# EasyEDA Pro project ProPrj_New Project_2026-07-15_23-14-34_2026-07-27.epro, board PCB2
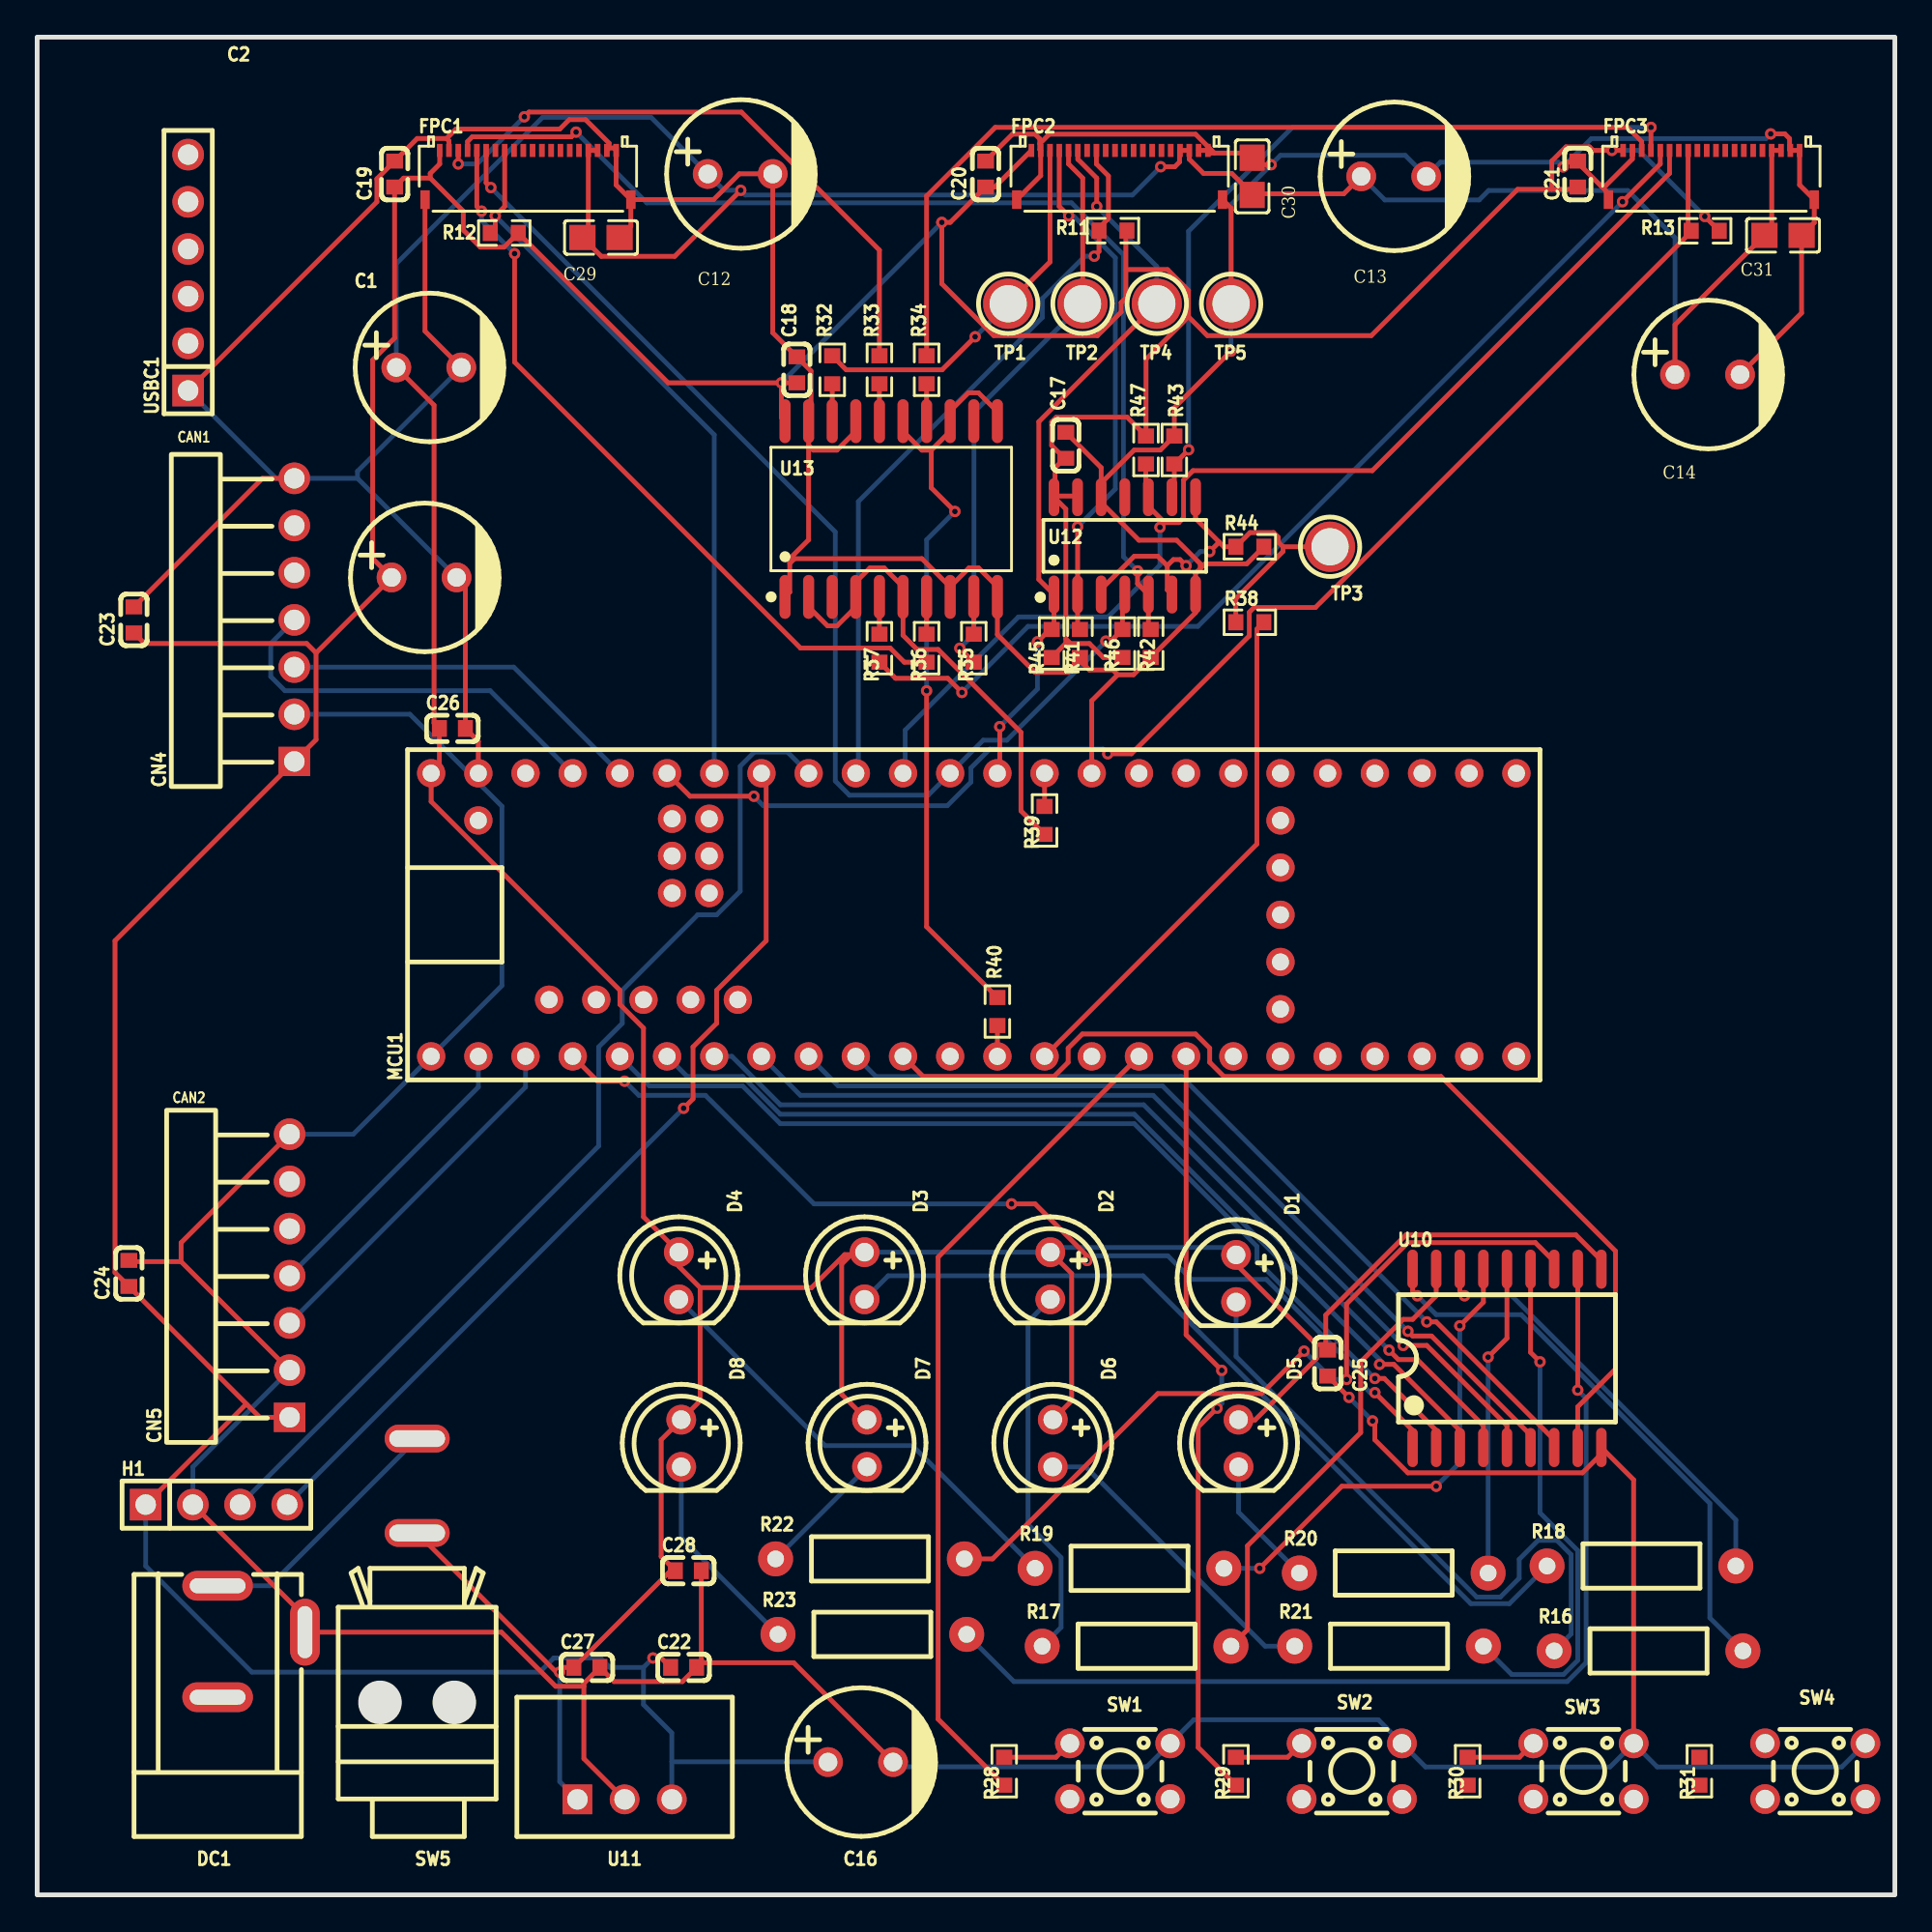
[diagram p5: board, top side]
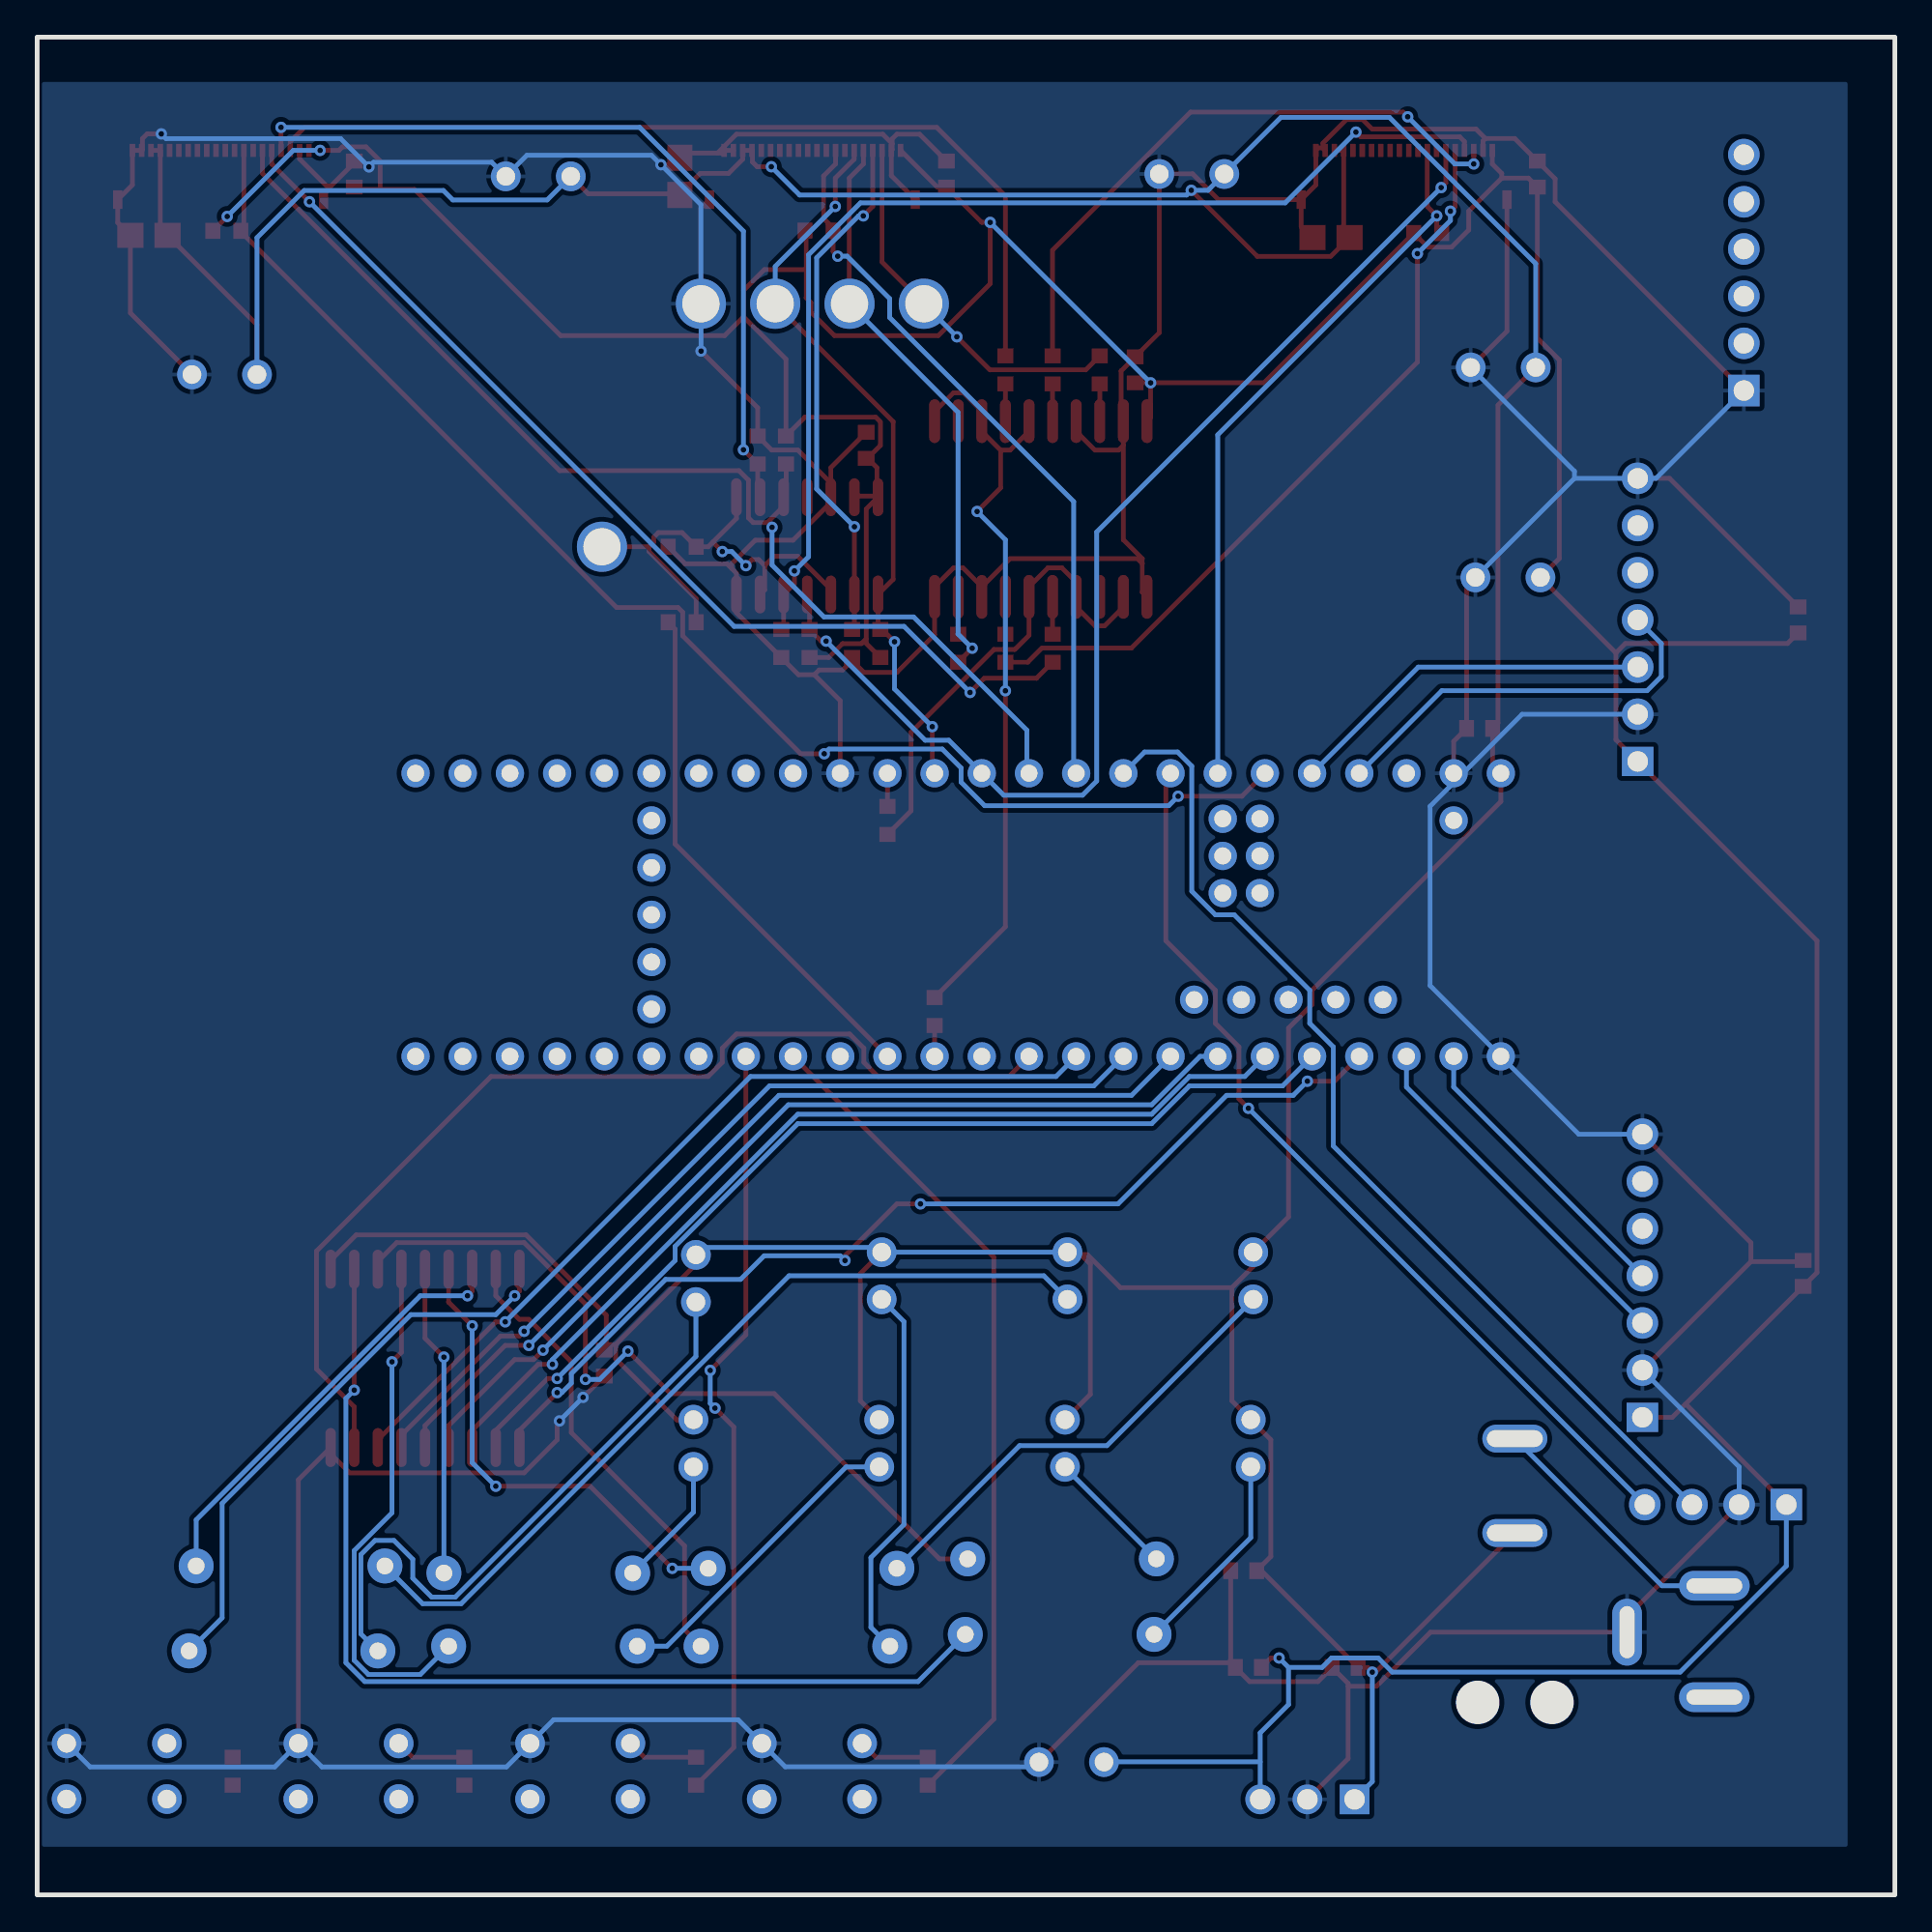
[diagram p6: board, bottom side, seen from below]

Outline 100 x 100 mm; copper layers: Top Layer, Bottom Layer. Coordinates in mm from the lower left corner of the outline.
Outline path: rectangle 0,100 100,0
Stack: Top Layer 0.035mm / Dielectric1 1.51mm FR4 er 4.5 / Bottom Layer 0.035mm

## Design rules (mm)
spacing copperThickness1oz (default): track to track 0.102, other pairs 0.152 to 0.3
spacing copperThickness2oz: track to track 0.203, other pairs 0.152 to 0.3
track width copperThickness1oz (default): min 0.127, default 0.254, max 2.54
track width copperThickness2oz: min 0.203, default 0.254, max 2.54
differential pair differentialPair (default): width min 0.127, default 0.254, max 2.54; gap min 0.152, default 0.152
net GND uses copperRegion

## Placement (name value [footprint] x y rotation side)
C1  220µF 25V  [CAP-TH_BD8.0-P3.50-D0.6-FD]  21.08 82.22 0 top
C2  220µF 25V  [CAP-TH_BD8.0-P3.50-D0.6-FD]  20.83 70.92 0 top
C12  220µF 25V  [CAP-TH_BD8.0-P3.50-D0.6-FD]  37.85 92.63 0 top
C13  220µF 25V  [CAP-TH_BD8.0-P3.50-D0.6-FD]  73.02 92.51 0 top
C14  220µF 25V  [CAP-TH_BD8.0-P3.50-D0.6-FD]  89.92 81.84 0 top
C16  220µF 25V  [CAP-TH_BD8.0-P3.50-D0.6-FD]  44.32 7.15 0 top
C17  100nF  [C0603]  55.37 78.03 90 top
C18  100nF  [C0603]  40.89 82.09 90 top
C19  100nF  [C0603]  19.24 92.63 90 top
C20  100nF  [C0603]  51.05 92.63 90 top
C21  100nF  [C0603]  82.93 92.63 90 top
C22  100nF  [C0603]  34.8 12.24 0 top
C23  100nF  [C0603]  5.21 68.63 90 top
C24  100nF  [C0603]  4.94 33.45 90 top
C25  100nF  [C0603]  69.47 28.63 270 top
C26  100nF  [C0603]  22.35 62.79 0 top
C27  100nF  [C0603]  29.59 12.24 0 top
C28  100nF  [C0603]  35.05 17.45 0 top
C29  10uF  [C0805]  30.35 89.22 0 top
C30  10uF  [C0805]  65.41 92.51 90 top
C31  10uF  [C0805]  93.98 89.33 0 top
CN4  1x7 header 2.54mm  [CONN-TH_7P-P2.54_C9900012194]  13.84 68.63 90 top
CN5  1x7 header 2.54mm  [CONN-TH_7P-P2.54_C9900012194]  13.59 33.32 90 top
D1  5mm LED GREEN  [LED-TH_BD5.0-P2.54-FD]  64.54 33.18 270 top
D2  5mm LED WHITE  [LED-TH_BD5.0-P2.54-FD]  54.54 33.32 270 top
D3  5mm LED BLUE  [LED-TH_BD5.0-P2.54-FD]  44.54 33.32 270 top
D4  5mm LED GREEN  [LED-TH_BD5.0-P2.54-FD]  34.54 33.32 270 top
D5  5mm LED AMBER  [LED-TH_BD5.0-P2.54-FD]  64.67 24.31 270 top
D6  5mm LED RED  [LED-TH_BD5.0-P2.54-FD]  54.67 24.31 270 top
D7  5mm LED RED  [LED-TH_BD5.0-P2.54-FD]  44.67 24.31 270 top
D8  5mm LED YELLOW  [LED-TH_BD5.0-P2.54-FD]  34.67 24.31 270 top
DC1  DC-005 5.5x2.5 5A  [DC-IN-TH_DC-005-2]  12.06 13.64 90 top
FPC1  RiBus LEFT panel  [FPC-SMD_5034802000]  26.42 92.58 0 top
FPC2  RiBus CENTER panel  [FPC-SMD_5034802000]  58.27 92.58 0 top
FPC3  RiBus RIGHT panel  [FPC-SMD_5034802000]  90.12 92.58 0 top
H1  PZ254V-11-04P  [HDR-TH_4P-P2.54-V-M]  9.65 21.01 0 top
MCU1  TEENSY41  [COMM-TH_L60.1-W17.8-P2.54]  50.42 52.76 90 top
R11  10kΩ  [R0603]  57.91 89.59 0 top
R12  10kΩ  [R0603]  25.15 89.46 0 top
R13  10kΩ  [R0603]  89.79 89.57 0 top
R16  150Ω  [R_AXIAL-0.4]  86.74 13.13 0 top
R17  82Ω  [R_AXIAL-0.4]  59.18 13.39 0 top
R18  82Ω  [R_AXIAL-0.4]  86.36 17.7 0 top
R19  150Ω  [R_AXIAL-0.4]  58.8 17.58 0 top
R20  180Ω  [R_AXIAL-0.4]  73.02 17.32 0 top
R21  150Ω  [R_AXIAL-0.4]  72.77 13.39 0 top
R22  150Ω  [R_AXIAL-0.4]  44.83 18.08 0 top
R23  180Ω  [R_AXIAL-0.4]  44.96 14.02 0 top
R28  1kΩ  [R0603]  52.06 6.66 270 top
R29  1kΩ  [R0603]  64.53 6.66 270 top
R30  1kΩ  [R0603]  77 6.66 270 top
R31  1kΩ  [R0603]  89.48 6.66 270 top
R32  33Ω  [R0603]  42.8 82.09 90 top
R33  33Ω  [R0603]  45.34 82.09 90 top
R34  33Ω  [R0603]  47.88 82.09 90 top
R35  33Ω  [R0603]  50.42 67.11 270 top
R36  33Ω  [R0603]  47.88 67.11 270 top
R37  33Ω  [R0603]  45.34 67.11 270 top
R38  33Ω  [R0603]  65.28 68.5 0 top
R39  33Ω  [R0603]  54.23 57.84 270 top
R40  33Ω  [R0603]  51.69 47.55 90 top
R41  100kΩ  [R0603]  56.13 67.36 270 top
R42  100kΩ  [R0603]  59.94 67.36 270 top
R43  100kΩ  [R0603]  61.21 77.77 90 top
R44  100kΩ  [R0603]  65.28 72.57 0 top
R45  10kΩ  [R0603]  54.61 67.36 270 top
R46  10kΩ  [R0603]  58.42 67.36 270 top
R47  10kΩ  [R0603]  59.69 77.77 90 top
SW1  tact 4.5x4.5 THT  [SW-TH_4P-L4.5-W4.5-P3.00-LS5.4]  58.29 6.66 0 top
SW2  tact 4.5x4.5 THT  [SW-TH_4P-L4.5-W4.5-P3.00-LS5.4]  70.77 6.66 0 top
SW3  tact 4.5x4.5 THT  [SW-TH_4P-L4.5-W4.5-P3.00-LS5.4]  83.24 6.66 0 top
SW4  tact 4.5x4.5 THT  [SW-TH_4P-L4.5-W4.5-P3.00-LS5.4]  95.71 6.66 0 top
SW5  SS01-BBIWL-RP20-R  [SW-TH_SS01-BBIWL-RP20-R]  20.46 22.02 0 top
TP1  TP SCLK_C  [TESTPOINT-TH_BD3.2]  52.27 85.65 0 top
TP2  TP MOSI_C  [TESTPOINT-TH_BD3.2]  56.27 85.65 0 top
TP3  TP MISO_NODE  [TESTPOINT-TH_BD3.2]  69.6 72.57 0 top
TP4  TP CS_C  [TESTPOINT-TH_BD3.2]  60.27 85.65 0 top
TP5  TP GND (scope ref)  [TESTPOINT-TH_BD3.2]  64.27 85.65 0 top
U10  ULN2803A  [SOIC-18_L11.6-W7.5-P1.27-LS10.3-BL]  79.12 28.88 0 top
U11  K7803-2000R3 3.3V 2A  [PWRM-TH_R-78EXX-1.0]  31.62 5.14 0 top
U12  SN74LVC125ADR  [SOIC-14_L8.7-W3.9-P1.27-LS6.0-BL]  58.55 72.62 0 top
U13  SN74LVC244ADWR  [SOIC-20_L13.0-W7.6-P1.27-LS10.3-BL]  45.97 74.6 0 top
USBC1  1x6 header 2.54mm  [HDR-TH_6P-P2.54-V-M_BLUE]  8.13 87.33 90 top

## Footprints (pads in the part's own frame, mm; a bottom-side part is the same pattern mirrored in y, then rotated)
C0603
  rect 0.8x0.9 smd: 1(-0.7,0) 2(0.7,0)
C0805
  rect 1.41x1.35 smd: 1(-1,0) 2(1,0)
CAP-TH_BD8.0-P3.50-D0.6-FD
  round 1.6 hole 1: 1(-1.75,0) 2(1.75,0)
COMM-TH_L60.1-W17.8-P2.54
  round 1.524 hole 0.914: 1(-7.62,29.21) 2(-7.62,26.67) 3(-7.62,24.13) 4(-7.62,21.59) 5(-7.62,19.05) 6(-7.62,16.51) 7(-7.62,13.97) 8(-7.62,11.43) 9(-7.62,8.89) 10(-7.62,6.35) 11(-7.62,3.81) 12(-7.62,1.27) 13(-7.62,-1.27) 14(-7.62,-3.81) 15(-7.62,-6.35) 16(-7.62,-8.89) 17(-7.62,-11.43) 18(-7.62,-13.97) 19(-7.62,-16.51) 20(-7.62,-19.05) 21(-7.62,-21.59) 22(-7.62,-24.13) 23(-7.62,-26.67) 24(-7.62,-29.21) 25(7.62,-29.21) 26(7.62,-26.67) 27(7.62,-24.13) 28(7.62,-21.59) 29(7.62,-19.05) 30(7.62,-16.51) 31(7.62,-13.97) 32(7.62,-11.43) 33(7.62,-8.89) 34(7.62,-6.35) 35(7.62,-3.81) 36(7.62,-1.27) 37(7.62,1.27) 38(7.62,3.81) 39(7.62,6.35) 40(7.62,8.89) 41(7.62,11.43) 42(7.62,13.97) 43(7.62,16.51) 44(7.62,19.05) 45(7.62,21.59) 46(7.62,24.13) 47(7.62,26.67) 48(7.62,29.21) 49(-4.57,22.86) 50(-4.57,20.32) 51(-4.57,17.78) 52(-4.57,15.24) 53(-4.57,12.7) 54(-5.08,-16.51) 55(-2.54,-16.51) 56(0,-16.51) 57(2.54,-16.51) 58(5.08,-16.51) 59(5.17,16.24) 60(5.17,14.24) 61(3.17,16.24) 62(3.17,14.24) 63(1.17,16.24) 64(1.17,14.24) 65(5.08,26.67)
CONN-TH_7P-P2.54_C9900012194
  rect 1.575x1.7 hole 1.1: 1(-7.62,0)
  round 1.7 hole 1.1: 2(-5.08,0) 3(-2.54,0) 4(0,0) 5(2.54,0) 6(5.08,0) 7(7.62,0)
DC-IN-TH_DC-005-2
  oval 1.6x3.8 hole 0.8x3: 1(2.999,2.35) 2(-3,2.35)
  oval 3.6x1.6 hole 2.8x0.8: 3(0.5,-2.35)
FPC-SMD_5034802000
  rect 0.3x0.7 smd: 1(-4.75,1.325) 2(-4.25,1.325) 3(-3.75,1.325) 4(-3.25,1.325) 5(-2.75,1.325) 6(-2.25,1.325) 7(-1.75,1.325) 8(-1.25,1.325) 9(-0.75,1.325) 10(-0.25,1.325) 11(0.25,1.325) 12(0.75,1.325) 13(1.25,1.325) 14(1.75,1.325) 15(2.25,1.325) 16(2.75,1.325) 17(3.25,1.325) 18(3.75,1.325) 19(4.25,1.325) 20(4.75,1.325)
  rect 0.5x1 smd: 21(5.54,-1.325) 22(-5.54,-1.325)
HDR-TH_4P-P2.54-V-M
  rect 1.7x1.7 hole 1.1: 1(-3.81,0)
  round 1.7 hole 1.1: 2(-1.27,0) 3(1.27,0) 4(3.81,0)
HDR-TH_6P-P2.54-V-M_BLUE
  rect 1.7x1.7 hole 1.1: 1(-6.35,0)
  round 1.7 hole 1.1: 2(-3.81,0) 3(-1.27,0) 4(1.27,0) 5(3.81,0) 6(6.35,0)
LED-TH_BD5.0-P2.54-FD
  round 1.6 hole 1: 1(-1.27,0) 2(1.27,0)
PWRM-TH_R-78EXX-1.0
  rect 1.6x1.6 hole 1.1: 1(-2.54,0)
  round 1.6 hole 1.1: 2(0,0) 3(2.54,0)
R0603
  rect 0.806x0.864 smd: 1(-0.753,0) 2(0.753,0)
R_AXIAL-0.4
  round 1.879 hole 0.899: 1(-5.08,0) 2(5.08,0)
SOIC-14_L8.7-W3.9-P1.27-LS6.0-BL
  oval 0.574x2.038 smd: 1(-3.81,-2.619) 2(-2.54,-2.619) 3(-1.27,-2.619) 4(0,-2.619) 5(1.27,-2.619) 6(2.54,-2.619) 7(3.81,-2.619) 8(3.81,2.619) 9(2.54,2.619) 10(1.27,2.619) 11(0,2.619) 12(-1.27,2.619) 13(-2.54,2.619) 14(-3.81,2.619)
SOIC-18_L11.6-W7.5-P1.27-LS10.3-BL
  oval 0.56x2.1 smd: 1(-5.08,-4.8) 2(-3.81,-4.8) 3(-2.54,-4.8) 4(-1.27,-4.8) 5(0,-4.8) 6(1.27,-4.8) 7(2.54,-4.8) 8(3.81,-4.8) 9(5.08,-4.8) 10(5.08,4.8) 11(3.81,4.8) 12(2.54,4.8) 13(1.27,4.8) 14(0,4.8) 15(-1.27,4.8) 16(-2.54,4.8) 17(-3.81,4.8) 18(-5.08,4.8)
SOIC-20_L13.0-W7.6-P1.27-LS10.3-BL
  oval 0.595x2.36 smd: 1(-5.715,-4.73) 2(-4.445,-4.73) 3(-3.175,-4.73) 4(-1.905,-4.73) 5(-0.635,-4.73) 6(0.635,-4.73) 7(1.905,-4.73) 8(3.175,-4.73) 9(4.445,-4.73) 10(5.715,-4.73) 11(5.715,4.73) 12(4.445,4.73) 13(3.175,4.73) 14(1.905,4.73) 15(0.635,4.73) 16(-0.635,4.73) 17(-1.905,4.73) 18(-3.175,4.73) 19(-4.445,4.73) 20(-5.715,4.73)
SW-TH_4P-L4.5-W4.5-P3.00-LS5.4
  round 1.6 hole 1: 1(-2.7,1.5) 2(2.7,1.5) 3(-2.7,-1.5) 4(2.7,-1.5)
SW-TH_SS01-BBIWL-RP20-R
  oval 3.5x1.5 hole 3x0.9: 1(0,2.54) 1a(0,-2.54)
TESTPOINT-TH_BD3.2
  round 2.7 hole 2: 1(0,0)

## Nets
As in the schematic.

Pads without a net: DC1 2; FPC1 7 9 10 11 12 13 14 15 16; FPC2 7 9 10 11 12 13 14 15 16; FPC3 7 9 10 11 12 13 14 15 16; MCU1 12 15 20 21 22 23 24 25 26 27 28 29 30 31 32 33 46 49 50 51 52 53 54 55 56 57 58 59 60 61 62 63 64 65; R31 1; SW1 3 4; SW2 3 4; SW3 3 4; SW4 3 4; U12 11; U13 3 12

## Via types
v1: diameter 0.61, hole 0.305, Top Layer to Bottom Layer, 65 vias

## Routing (per net, layer and track width the routed paths; a pad name or vN(x,y) marks a point on that pad's centre or on a via; arc(x,y) is an arc through that point)
+3V3: length 291.2
  Top Layer w0.254: C18.1 33.97,81.39 R12.2 25.14,88.7 23.86,88.7 22.94,89.62 22.94,90.63 21.16,92.41 ; 15.01,66.85 C2.1 18.06,71.93 18.06,82.62 19.24,83.8 C19.1 19.72,92.41 21.16,92.41 ; 15.01,66.85 14.51,67.36 5.78,67.36 C23.1 ; 15.01,66.85 15.01,62.18 CN4.1 4.19,51.36 4.19,33.5 C24.1 11.98,25.7 13.59,25.7 ; 21.16,92.41 21.16,92.67 21.67,93.17 FPC1.1 ; R46.2 57.39,66.61 56.64,67.36 55.63,67.36 55.37,67.61 ; C22.1 33.59,12.75 v1(33.15,12.75) ; 58.6,87.49 60.85,87.49 61.98,86.36 61.98,84.95 ; FPC2.1 51.55,91.93 C20.1 49.15,90.03 v1(48.7,90.03) 48.7,86.73 51.49,83.93 57.08,83.93 58.35,85.2 58.35,85.71 58.6,85.96 58.6,89.52 R11.2 ; U12.13 55.95,75.3 54.79,75.3 ; 54.79,75.3 U12.14 55.37,74.6 55.37,67.37 R45.2 ; 54.79,75.3 54.79,76.82 55.3,77.33 ; 61.98,84.95 59.69,82.66 R47.2 58.67,79.54 54.86,79.54 54.61,79.29 54.61,78.02 55.3,77.33 ; 61.98,84.95 62.99,83.93 71.82,83.93 79.69,91.81 82.81,91.81 C21.1 ; 81.53,91.81 81.53,93.33 82.3,94.09 83.57,94.09 83.75,93.9 FPC3.1 ; 55.3,77.33 C17.1 ; H1.1 11.24,26.4 11.29,26.4 ; U13.20 40.06,79.53 v1(40.06,81.39) ; v1(89.77,90.35) R13.2
  Bottom Layer w0.254: 32.64,12.24 30.83,12.24 30.32,12.75 27.81,12.75 27.05,11.99 11.56,11.99 5.84,17.7 H1.1 ; 32.64,12.24 v1(33.15,12.75) ; 32.64,12.24 32.64,10.24 34.16,8.72 U11.3 ; v1(84.77,93.9) 86.21,93.9 v1(89.77,90.35) ; 34.16,7.16 42.56,7.16 C16.1 ; v1(40.06,81.39) v1(48.7,90.03)
+5V: length 304.3
  Top Layer w0.254: D7.1 43.31,26.94 43.31,33.95 43.82,34.46 ; 68.86,29.62 68.86,28.86 65.55,25.56 64.69,25.56 D5.1 ; 68.86,29.62 64.54,33.94 64.54,34.45 ; 68.86,29.62 69.27,29.62 69.36,29.53 69.36,29.43 ; v1(60.48,93.03) 61.24,93.03 61.5,93.28 61.5,93.88 FPC2.17 FPC2.18 62.02,93.43 62.78,92.67 64.31,92.67 65.41,91.57 ; 35.69,32.68 35.69,26.59 D8.1 33.59,24.5 33.59,18.21 34.35,17.45 34.1,17.45 C27.1 28.38,12.24 v1(28.13,11.99) 27.95,11.99 SW5.1a ; 35.69,32.68 34.54,33.83 D4.1 32.64,36.49 32.64,46.66 31.37,47.93 31.37,48.69 21.21,58.85 MCU1.48 21.65,60.82 C26.1 21.36,63.08 21.36,80.19 C1.1 ; 35.69,32.68 41.69,32.68 43.47,34.46 44.41,34.46 D3.1 ; 69.36,29.43 C25.1 ; 69.36,29.43 69.36,31.21 73.68,35.53 82.83,35.53 84.2,34.15 U10.10 ; v1(37.87,91.76) 34.32,88.2 30.37,88.2 C29.1 29.67,89.53 FPC1.17 FPC1.18 ; FPC3.18 FPC3.17 93.37,89.72 C31.1 88.17,84.52 C14.1 ; 65.41,91.57 C30.1 ; 65.41,91.57 70.33,91.57 C13.1 ; D2.1 55.69,33.45 55.69,26.59 D6.1
  Bottom Layer w0.254: U11.1 28.13,6.09 v1(28.13,11.99) ; C13.1 72.55,91.24 77.63,91.24 78.13,91.74 85.63,91.74 88.17,89.2 C14.1 ; D3.1 D2.1 54.79,34.85 64.14,34.85 64.54,34.45 ; C1.1 19.33,87.81 27.21,95.68 33.05,95.68 C12.1 36.97,91.76 v1(37.87,91.76) 38.13,91.5 58.96,91.5 v1(60.48,93.03)
+5V_SW_IN: length 14
  Bottom Layer w0.254: SW5.1 12.53,16.64 DC1.1
GND: length 503.9
  Top Layer w0.254: v1(64.26,83.1) 61.21,80.05 R43.2 60.46,77.77 59.05,77.77 57.28,76 U12.12 ; 35.75,12.5 C28.2 ; 35.75,12.5 C22.2 34.74,11.48 31.05,11.48 C27.2 29.43,11.38 29.43,11.23 ; 35.75,12.5 40.72,12.5 C16.2 ; 29.43,11.23 29.43,7.33 U11.2 ; 29.43,11.23 27.91,11.23 24.99,14.14 DC1.3 14.42,14.97 H1.2 ; 53.98,94.27 53.98,93.95 FPC2.2 54.02,92.54 FPC2.22 ; 53.98,94.27 53.98,94.52 53.72,94.78 52.5,94.78 C20.2 ; 53.98,94.27 54.48,94.78 62.36,94.78 63.37,93.76 ; SW3.2 85.94,22.34 U10.9 84.2,23.73 83.19,22.72 73.79,22.72 72.01,24.49 72.01,25.39 v1(71.88,25.51) ; FPC1.21 36.41,91.25 37.8,92.64 39.59,92.64 C12.2 39.6,84.09 C18.2 41.66,82.03 41.66,79.46 U13.19 41.53,78.02 ; FPC1.21 31.17,92.04 FPC1.20 31.04,94.04 30.79,94.04 ; FPC1.21 31.96,89.82 C29.2 ; 40.51,71.67 40.77,71.93 47.63,71.93 49.15,70.4 U13.8 49.15,70.41 50.17,71.43 50.67,71.43 51.69,70.41 U13.10 51.69,67.84 53.72,65.81 55.5,65.81 56.13,66.44 ; 30.79,94.04 30.79,94.29 29.52,95.56 28.64,95.56 28.13,95.05 22.55,95.05 22.04,94.54 ; 30.79,94.04 FPC1.19 ; TP5.1 64.27,90.79 FPC2.21 ; v1(82.14,93.01) 82.39,93.27 82.9,93.27 ; 56.13,66.44 56.64,65.93 57.91,65.93 58.17,65.68 ; 56.13,66.44 R41.2 ; 82.9,93.27 82.9,93.3 C21.2 ; 82.9,93.27 84.58,91.59 FPC3.22 ; 22.04,94.54 20.46,94.54 C19.2 18.29,92.38 18.29,91.14 USBC1.1 ; 22.04,94.54 22.17,94.41 FPC1.2 ; C17.2 57.28,76.82 U12.12 ; 13.84,76.25 12.13,76.25 5.21,69.33 ; 7.75,34.09 5,34.09 C24.2 ; 7.75,34.09 7.75,35.1 CN5.7 ; 7.75,34.09 CN5.2 ; v1(66.42,93.13) 65.78,93.13 C30.2 65.15,93.76 63.16,93.76 FPC2.20 FPC2.19 ; C2.2 23.05,70.44 C26.2 23.75,62.09 MCU1.47 ; U13.17 44.07,78.78 43.05,77.77 41.78,77.77 41.53,78.02 ; 84.17,92 84.43,92 85.87,93.44 FPC3.2 ; v1(70.61,26.78) C25.2 ; 62.61,71.4 62.61,71.65 61.34,72.92 59.31,72.92 57.28,74.95 U12.12 ; C1.2 20.88,84.17 FPC1.22 ; U13.1 40.51,70.12 40.51,71.93 41.53,72.94 41.53,78.02 ; v1(93.32,94.79) 94.08,94.79 94.33,94.54 94.33,93.94 FPC3.19 FPC3.20 94.87,92.04 FPC3.21 95.66,90.01 C31.2 94.98,85.15 C14.2 ; 58.17,65.68 56.77,64.28 MCU1.34 ; 58.17,65.68 59.02,65.68 R42.2 62.36,69.02 U12.7 62.36,71.14 62.86,71.65 65.11,71.65 R44.2
  Bottom Layer w0.254: v1(93.32,94.79) 93.06,94.54 83.67,94.54 v1(82.14,93.01) 81.89,93.27 75.54,93.27 C13.2 73.64,93.64 66.93,93.64 v1(66.42,93.13) 64.27,90.98 TP5.1 64.26,85.64 v1(64.26,83.1) ; CN5.7 17.02,40.94 MCU1.1 25.02,48.95 25.02,58.6 23.75,59.87 ; H1.2 8.38,23.04 CN5.2 ; C2.2 17.24,76.25 ; 17.24,76.25 17.24,76.63 C1.2 ; 17.24,76.25 12.85,76.25 USBC1.1 ; v1(71.88,25.51) v1(70.61,26.78) ; 23.75,59.87 MCU1.47 ; 23.75,59.87 20.07,63.55 13.84,63.55 ; C16.2 46.33,6.89 59.73,6.89 SW1.2 62.26,9.42 72.2,9.42 SW2.2 74.74,6.88 84.67,6.88 SW3.2 87.21,6.88 97.14,6.88 98.41,8.16
BTN1: length 45.2
  Top Layer w0.254: R28.2 48.5,9.46 48.5,34.33 MCU1.16
BTN1_SW: length 3.8
  Top Layer w0.254: R28.1 54.85,7.41 SW1.1
BTN2: length 41.4
  Top Layer w0.254: MCU1.17 61.85,30.15 v1(63.77,28.23) ; v1(63.51,26.2) 62.5,25.18 62.5,7.93 R29.2
  Bottom Layer w0.254: v1(63.77,28.23) 63.77,26.45 v1(63.51,26.2)
BTN2_SW: length 3.8
  Top Layer w0.254: R29.1 67.32,7.41 SW2.1
BTN3_SW: length 3.8
  Top Layer w0.254: R30.1 79.79,7.41 SW3.1
CAN1_RX: length 22
  Bottom Layer w0.254: MCU1.45 24.38,64.82 13.34,64.82 12.57,65.58 12.57,67.36 CN4.4
CAN1_TX: length 19.9
  Bottom Layer w0.254: CN4.3 25.65,66.09 MCU1.44
CAN2_RX: length 16
  Bottom Layer w0.254: MCU1.2 23.75,43.48 CN5.4
CAN2_TX: length 19.6
  Bottom Layer w0.254: 13.59,30.78 26.29,43.48 MCU1.3
CS_C: length 39.6
  Top Layer w0.254: v1(51.82,62.88) 51.82,60.5 MCU1.36 ; TP4.1 53.92,79.3 53.92,70.81 U12.1 54.74,68.34 54.61,68.22 ; v1(57.04,90.89) 57.04,92.41 56.02,93.43 FPC2.6 ; 54.61,68.22 R45.1 ; 54.61,68.22 v1(53.85,67.45)
  Bottom Layer w0.254: v1(51.82,62.88) 53.85,64.91 v1(53.85,67.45) ; v1(57.04,90.89) 60.27,87.65 TP4.1
CS_L: length 63.1
  Top Layer w0.254: U12.4 58.42,69.87 R46.1 57.79,67.49 v1(57.53,67.49) ; v1(24.42,91.9) 24.17,92.16 FPC1.6
  Bottom Layer w0.254: v1(57.53,67.49) 52.2,62.15 50.93,62.15 MCU1.37 47.97,59.19 43.73,59.19 42.96,59.96 42.96,73.36 v1(24.42,91.9)
CS_R: length 63.3
  Top Layer w0.254: 60.69,73.87 v1(60.44,73.62) ; 60.69,73.87 61.46,73.87 61.71,74.12 61.71,76.16 62.22,76.66 71.87,76.66 87.87,92.67 FPC3.6 ; 60.69,73.87 59.68,74.89 59.68,77.01 R47.1 ; U12.10 59.72,75.14 59.68,75.14
  Bottom Layer w0.254: MCU1.38 46.72,60.49 46.72,62.69 52.82,68.79 57.65,68.79 60.44,71.58 v1(60.44,73.62)
I2C_SCL: length 50.2
  Top Layer w0.254: MCU1.41 39.24,60.12 39.24,51.36 36.58,48.69 36.58,46.91 35.31,45.64 35.31,42.85 v1(34.8,42.34)
  Bottom Layer w0.254: H1.4 v1(34.8,42.34)
I2C_SDA: length 56
  Bottom Layer w0.254: H1.3 30.23,40.31 30.23,45.64 31.5,46.91 31.5,48.69 35.56,52.76 36.58,52.76 37.85,54.03 37.85,60.76 38.61,61.52 40.38,61.52 MCU1.40
MISO: length 28.3
  Top Layer w0.254: MCU1.14 65.66,56.57 65.66,68.13 R38.2
MISO_C: length 28.1
  Top Layer w0.254: v1(55.53,90.38) 55.02,90.89 FPC2.4 ; v1(56.01,73.65) U12.2 56.01,68.24 R41.1
  Bottom Layer w0.254: v1(56.01,73.65) 58.04,75.68 58.04,88.12 55.78,90.38 v1(55.53,90.38)
MISO_L: length 59.5
  Top Layer w0.254: v1(59.24,71.27) 59.24,70.58 U12.5 59.82,68.24 R42.1 ; FPC1.4 23.17,94.38 23.42,94.64 28.76,94.64 v1(29.01,94.89)
  Bottom Layer w0.254: v1(29.01,94.89) 32.82,91.08 55.68,91.08 58.47,88.29 58.47,72.03 v1(59.24,71.27)
MISO_NODE: length 24.9
  Top Layer w0.254: U12.8 62.36,74.09 63.88,72.57 R44.1 65.29,73.33 66.56,73.33 66.81,73.08 66.81,72.82 67.06,72.57 ; R38.1 64.52,69.77 67.06,72.31 67.06,72.57 ; 60.83,71.55 60.83,70.25 U12.6 ; 60.83,71.55 61.16,71.88 61.52,71.88 v1(61.85,71.55) ; 60.83,71.55 60.33,72.06 59.05,72.06 57.28,70.28 U12.3 ; 67.06,72.57 TP3.1 ; 63.63,72.82 v1(63.12,72.31)
  Bottom Layer w0.254: v1(61.85,71.55) 62.61,72.31 v1(63.12,72.31)
MISO_R: length 43.1
  Top Layer w0.254: v1(61.98,77.79) R43.1 61.21,75.36 U12.9 ; FPC3.4 v1(86.87,95.14)
  Bottom Layer w0.254: v1(86.87,95.14) 67.57,95.14 61.98,89.56 v1(61.98,77.79)
MOSI: length 41.1
  Top Layer w0.254: v1(47.88,64.81) 47.88,52.11 R40.2 ; U13.11 51.69,79.84 50.67,80.85 50.13,80.85 49.15,79.88 U13.13 49.15,78.78 48.13,77.77 ; 48.13,77.77 48.13,75.74 v1(49.4,74.47) ; 48.13,77.77 47.63,77.77 46.61,78.78 U13.15
  Bottom Layer w0.254: v1(47.88,64.81) 47.88,72.94 v1(49.4,74.47)
MOSI_C: length 30.9
  Top Layer w0.254: FPC2.5 55.52,93.17 56.28,92.41 56.28,85.66 TP2.1 ; v1(49.67,67.11) R35.2
  Bottom Layer w0.254: TP2.1 50.43,79.81 50.43,67.87 v1(49.67,67.11)
MOSI_C_PRE: length 2
  Top Layer w0.254: U13.9 R35.1
MOSI_L: length 41.1
  Top Layer w0.254: v1(23.92,90.63) 23.67,90.89 FPC1.5 ; R36.2 46.68,66.35 45.92,67.12 41.09,67.12 25.7,82.51 v1(25.7,88.35)
  Bottom Layer w0.254: v1(23.92,90.63) 23.92,90.13 v1(25.7,88.35)
MOSI_L_PRE: length 2
  Top Layer w0.254: U13.7 R36.1
MOSI_MCU: length 1.7
  Top Layer w0.254: MCU1.13 R40.1
MOSI_R: length 55.2
  Top Layer w0.254: R37.2 46.2,65.49 49.02,65.49 v1(49.78,64.73) ; FPC3.5 87.37,93.17 v1(85.34,91.14)
  Bottom Layer w0.254: v1(85.34,91.14) 62.48,68.28 53.34,68.28 v1(49.78,64.73)
MOSI_R_PRE: length 2
  Top Layer w0.254: U13.5 R37.1
PD_C: length 39.9
  Top Layer w0.254: 57.16,89.73 57.16,88.46 v1(56.9,88.21) ; 57.16,89.73 R11.1 ; 57.16,89.73 57.67,90.24 57.67,92.53 57.02,93.17 FPC2.8
  Bottom Layer w0.254: v1(56.9,88.21) 56.4,88.21 54.11,85.92 54.11,84.91 44.2,75 44.2,60.51 MCU1.39
PD_L: length 39.7
  Top Layer w0.254: R12.1 24.66,89.73 v1(24.66,90.38) 25.17,90.89 FPC1.8
  Bottom Layer w0.254: v1(24.66,90.38) 36.45,78.59 MCU1.42
PD_R: length 74.7
  Top Layer w0.254: 88.87,89.87 88.87,89.36 68.81,69.3 65.5,69.3 65.25,69.04 65.25,67.77 58.9,61.42 v1(57.63,61.42) ; 88.87,89.87 R13.1 ; 88.87,89.87 FPC3.8 ; v1(38.58,59.14) 35.15,59.14 MCU1.43
  Bottom Layer w0.254: v1(38.58,59.14) 39.09,58.63 48.99,58.63 50.26,59.9 50.26,60.66 51.28,61.68 57.38,61.68 v1(57.63,61.42)
SCLK: length 25.7
  Top Layer w0.254: U13.2 41.53,69.32 42.55,68.31 43.05,68.31 44.07,69.32 U13.4 44.07,70.67 44.83,71.43 45.59,71.43 46.61,70.41 U13.6 46.61,67.8 47.37,67.04 48.5,67.04 52.96,62.58 52.96,58.35 R39.2
SCLK_C: length 20.4
  Top Layer w0.254: R32.2 43.55,82.09 48.71,82.09 v1(50.49,83.87) ; TP1.1 54.52,87.9 FPC2.3
  Bottom Layer w0.254: TP1.1 v1(50.49,83.87)
SCLK_C_PRE: length 2
  Top Layer w0.254: U13.18 R32.1
SCLK_L: length 33.3
  Top Layer w0.254: FPC1.3 v1(22.67,93.17) ; v1(26.22,95.71) 26.48,95.97 37.91,95.97 45.34,88.54 R33.2
  Bottom Layer w0.254: v1(26.22,95.71) 23.68,93.17 v1(22.67,93.17)
SCLK_L_PRE: length 2
  Top Layer w0.254: U13.16 R33.1
SCLK_MCU: length 1.8
  Top Layer w0.254: MCU1.35 R39.1
SCLK_R: length 49.4
  Top Layer w0.254: R34.2 47.88,91.45 51.57,95.14 85.61,95.14 86.37,94.38 FPC3.3
SCLK_R_PRE: length 2
  Top Layer w0.254: U13.14 R34.1
TT1: length 55.1
  Top Layer w0.254: U10.1 74.04,25 v1(72.01,27.03) ; MCU1.4 30.17,43.8 v1(31.62,43.8) ; v1(56.52,34.15) 56.52,34.4 53.72,37.19 v1(52.45,37.19)
  Bottom Layer w0.254: v1(72.01,27.03) 71.76,27.03 71.25,27.54 71.25,28.05 66.17,33.13 62.14,33.13 60.86,34.4 56.77,34.4 v1(56.52,34.15) ; v1(52.45,37.19) 41.82,37.19 35.97,43.04 32.39,43.04 v1(31.62,43.8)
TT1_LED_K: length 34.1
  Bottom Layer w0.254: R16.1 82.57,14.04 82.57,18.32 81.81,19.08 80.8,19.08 79.78,18.06 79.78,17.05 78.76,16.03 77.49,16.03 64.54,28.98 D1.2
TT1_OUT: length 30.6
  Top Layer w0.254: U10.18 74.04,32.5 v1(74.3,32.25)
  Bottom Layer w0.254: R16.2 90.04,14.91 90.04,21.07 79.88,31.23 75.31,31.23 v1(74.3,32.25)
TT2: length 53.7
  Top Layer w0.254: v1(72.01,27.8) 72.52,27.8 75.31,25 U10.2
  Bottom Layer w0.254: MCU1.5 32.96,43.54 37.97,43.54 40.01,41.51 59.05,41.51 65.66,34.91 65.66,34.15 v1(72.01,27.8)
TT2_LED_K: length 20.3
  Bottom Layer w0.254: D2.2 53.34,30.86 53.34,19.93 55.12,18.16 55.12,14.4 R17.1
TT2_OUT: length 25.2
  Top Layer w0.254: U10.17 75.31,32.25 74.04,30.98 73.53,30.98 71.25,28.69 71.25,24.88 65.15,18.79 65.15,14.28 R17.2
TT3: length 52.1
  Top Layer w0.254: v1(72.26,28.56) 73.02,28.56 76.58,25 U10.3
  Bottom Layer w0.254: v1(72.26,28.56) 72.26,28.81 59.05,42.02 40.01,42.02 37.97,44.05 34.99,44.05 MCU1.6
TT3_LED_K: length 45.4
  Bottom Layer w0.254: R18.1 79.25,15.67 77.18,15.67 59.52,33.32 45.81,33.32 D3.2
TT3_OUT: length 23.6
  Top Layer w0.254: v1(76.83,32.25) 76.58,32.5 U10.16
  Bottom Layer w0.254: v1(76.83,32.25) 79.38,32.25 91.44,20.18 R18.2
TT4: length 50.8
  Top Layer w0.254: v1(72.77,29.32) 73.28,28.81 74.3,28.81 77.85,25.26 U10.4
  Bottom Layer w0.254: MCU1.7 37.4,45.14 40.01,42.53 59.56,42.53 v1(72.77,29.32)
TT4_LED_K: length 25.2
  Bottom Layer w0.254: R19.1 47.12,24.18 42.41,24.18 D4.2
TT4_OUT: length 26
  Top Layer w0.254: v1(75.31,22) 70.23,22 v1(65.81,17.58) ; U10.15 77.85,31.9 v1(76.58,30.63)
  Bottom Layer w0.254: v1(75.31,22) 76.58,23.27 v1(76.58,30.63) ; v1(65.81,17.58) R19.2
TT5: length 49.5
  Top Layer w0.254: v1(73.53,29.57) 74.8,29.57 79.12,25.26 U10.5
  Bottom Layer w0.254: v1(73.53,29.57) 60.07,43.04 41.09,43.04 MCU1.8
TT5_LED_K: length 7.1
  Bottom Layer w0.254: R20.1 64.67,20.6 D5.2
TT5_OUT: length 16.8
  Top Layer w0.254: v1(78.11,28.95) 79.12,29.96 U10.14
  Bottom Layer w0.254: v1(78.11,28.95) R20.2
TT6: length 48
  Top Layer w0.254: v1(73.79,30.34) 74.04,30.08 75.06,30.08 80.39,24.75 U10.6
  Bottom Layer w0.254: MCU1.9 43.12,43.54 60.58,43.54 v1(73.79,30.34)
TT6_LED_K: length 17
  Bottom Layer w0.254: R21.1 66.1,13.39 56.45,23.04 D6.2
TT6_OUT: length 28.1
  Top Layer w0.254: v1(80.9,28.69) 80.39,29.2 U10.13
  Bottom Layer w0.254: v1(80.9,28.69) 80.9,20.56 82.93,18.53 82.93,12.62 82.17,11.86 79.38,11.86 R21.2
TT7: length 46.6
  Top Layer w0.254: v1(74.8,30.84) 75.31,30.84 81.66,24.49 U10.7
  Bottom Layer w0.254: MCU1.10 45.15,44.05 61.6,44.05 v1(74.8,30.84)
TT7_LED_K: length 7
  Bottom Layer w0.254: D7.2 44.67,23 R22.1
TT7_OUT: length 43.3
  Top Layer w0.254: v1(70.48,27.74) 70.48,31.81 73.79,35.11 80.64,35.11 81.66,34.09 U10.12 ; R22.2 51.43,18.08 60.33,26.98 65.91,26.98 v1(68.2,29.27)
  Bottom Layer w0.254: v1(68.2,29.27) 69.72,27.74 v1(70.48,27.74)
TT8: length 56.9
  Top Layer w0.254: U10.8 82.93,26.27 84.96,28.3 84.96,34.65 75.57,44.05 63.88,44.05 63.12,44.81 63.12,45.58 62.36,46.34 56.26,46.34 55.5,45.58 55.5,44.81 54.74,44.05 47.69,44.05 MCU1.11
TT8_LED_K: length 11.2
  Bottom Layer w0.254: D8.2 34.67,19.23 R23.1
TT8_OUT: length 56.2
  Top Layer w0.254: U10.11 v1(82.93,27.17)
  Bottom Layer w0.254: R23.2 52.58,11.48 82.36,11.48 83.38,12.5 83.38,26.72 v1(82.93,27.17)

## Copper pours and planes (outline as drawn; the poured copper is in the pictures)
GND on Bottom Layer: 2.54,97.59 197.54,97.59 197.54,2.59 2.54,2.59

## Text on the board
Top Silkscreen Layer: CAN2 | CAN1
